# EAGLE design SPI-i2c-PWM --v1 (EAGLE 9.5.2)
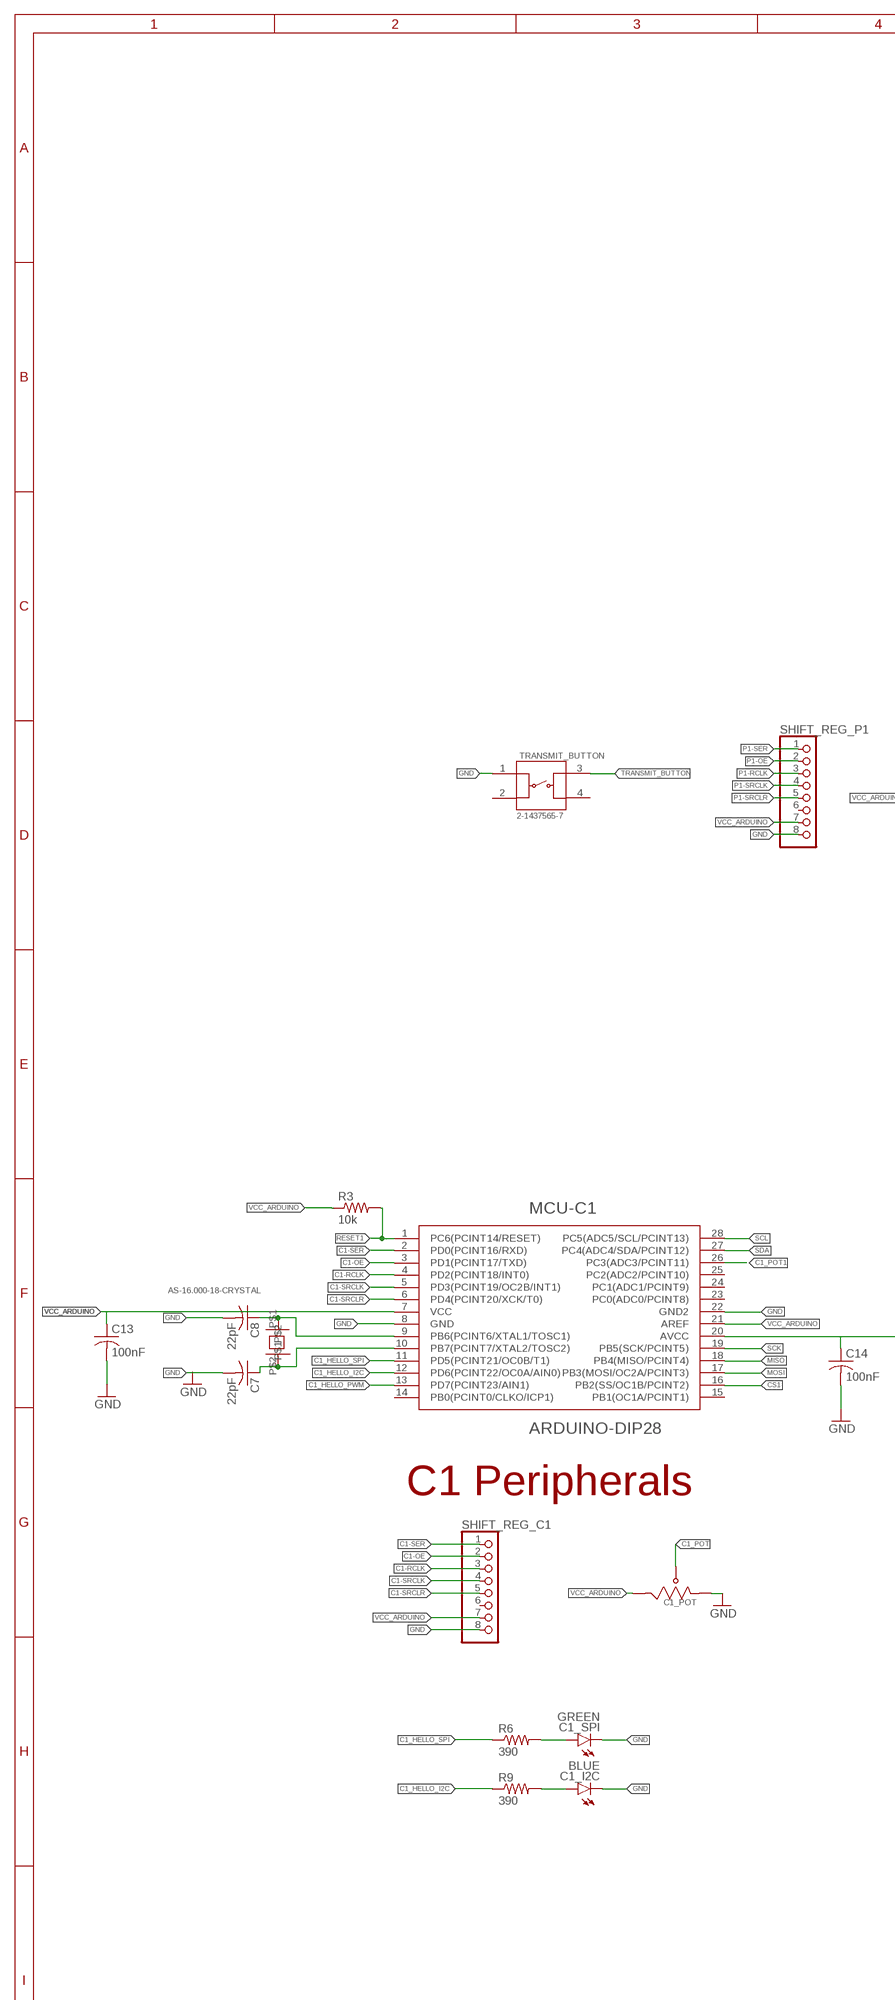
[diagram p0: schematic, sheet 1, part 1 of 2]
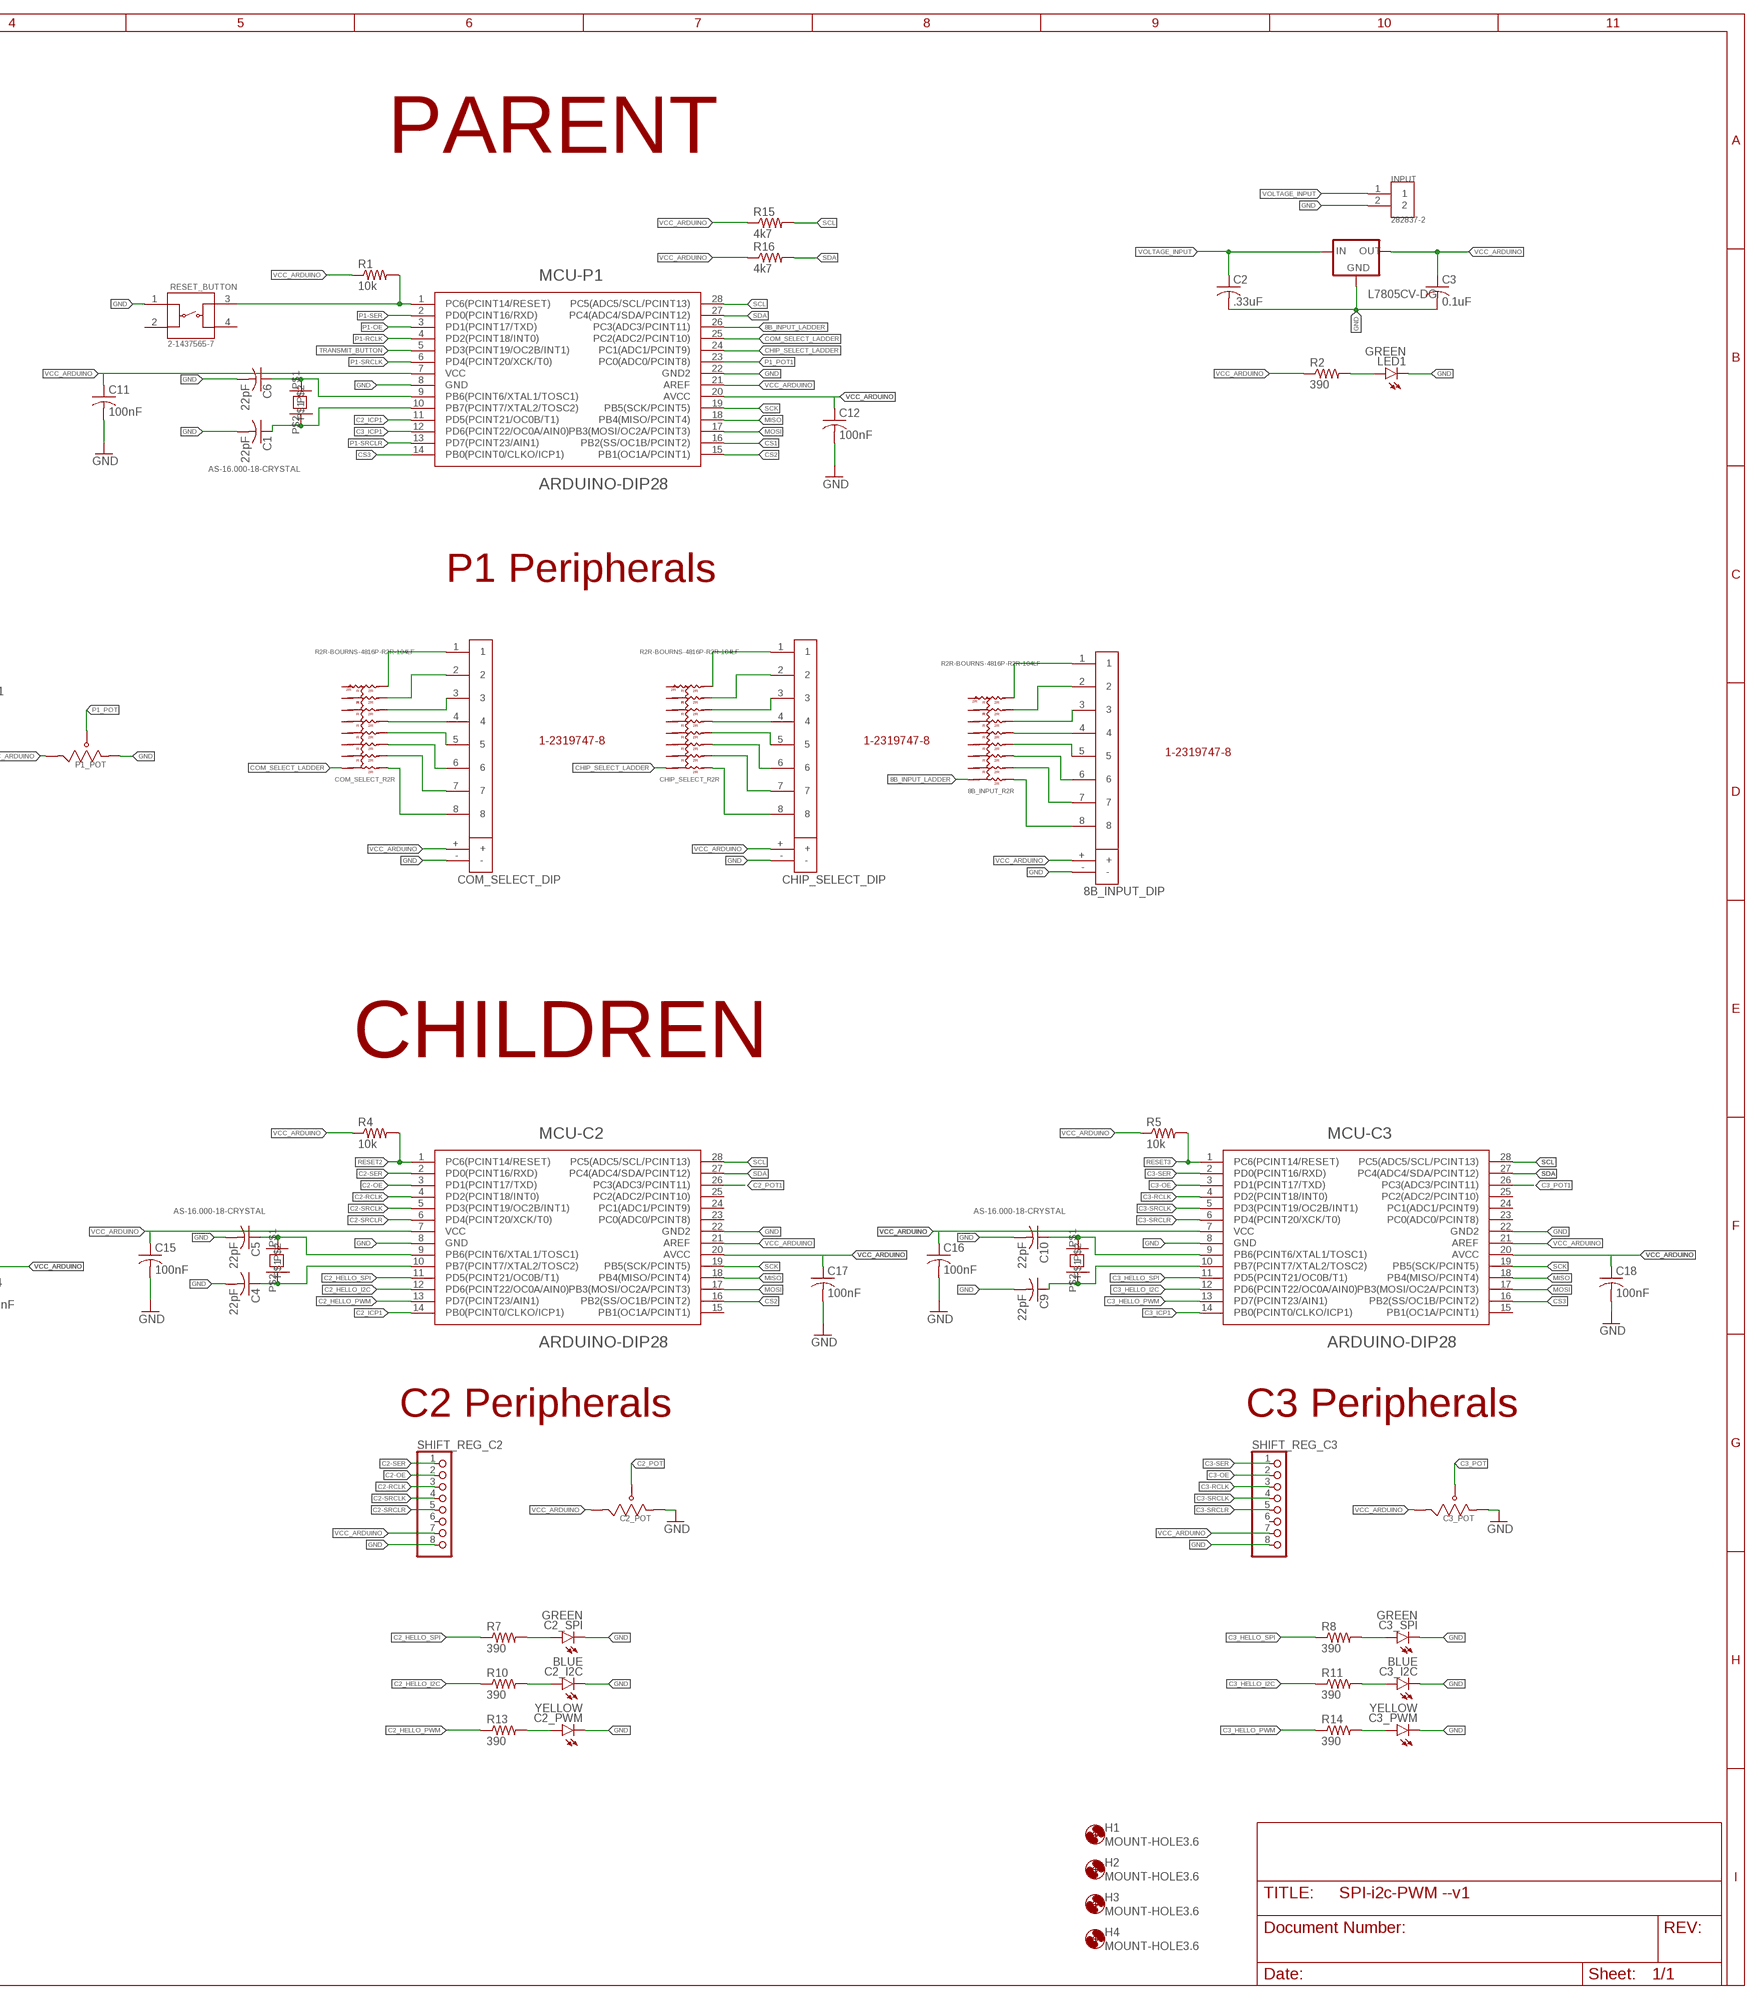
[diagram p1: schematic, sheet 1, part 2 of 2]

## Parts
5V_REG  L7805CV-DG  78XXS  [78XXS]
8B_INPUT_DIP  DIP8-TE  [DIP8-TE(1-2319747-8)]
8B_INPUT_R2R  R2R-BOURNS-4816P-R2R-104LF  [R2RLADDER]
C1  22pF  C-USC0805  [C0805]
C1_I2C  BLUE  LEDCHIP-LED0805  [CHIP-LED0805]
C1_POT  POTENTIOMETER-ALLIE  [POT-ALLIEEXPRESS]
C1_SPI  GREEN  LEDCHIP-LED0805  [CHIP-LED0805]
C2  .33uF  C-USC0805  [C0805]
C2_I2C  BLUE  LEDCHIP-LED0805  [CHIP-LED0805]
C2_POT  POTENTIOMETER-ALLIE  [POT-ALLIEEXPRESS]
C2_PWM  YELLOW  LEDCHIP-LED0805  [CHIP-LED0805]
C2_SPI  GREEN  LEDCHIP-LED0805  [CHIP-LED0805]
C3  0.1uF  C-USC0805  [C0805]
C3_I2C  BLUE  LEDCHIP-LED0805  [CHIP-LED0805]
C3_POT  POTENTIOMETER-ALLIE  [POT-ALLIEEXPRESS]
C3_PWM  YELLOW  LEDCHIP-LED0805  [CHIP-LED0805]
C3_SPI  GREEN  LEDCHIP-LED0805  [CHIP-LED0805]
C4  22pF  C-USC0805  [C0805]
C5  22pF  C-USC0805  [C0805]
C6  22pF  C-USC0805  [C0805]
C7  22pF  C-USC0805  [C0805]
C8  22pF  C-USC0805  [C0805]
C9  22pF  C-USC0805  [C0805]
C10  22pF  C-USC0805  [C0805]
C11  100nF  C-USC0805  [C0805]
C12  100nF  C-USC0805  [C0805]
C13  100nF  C-USC0805  [C0805]
C14  100nF  C-USC0805  [C0805]
C15  100nF  C-USC0805  [C0805]
C16  100nF  C-USC0805  [C0805]
C17  100nF  C-USC0805  [C0805]
C18  100nF  C-USC0805  [C0805]
CHIP_SELECT_DIP  DIP8-TE  [DIP8-TE(1-2319747-8)]
CHIP_SELECT_R2R  R2R-BOURNS-4816P-R2R-104LF  [R2RLADDER]
COM_SELECT_DIP  DIP8-TE  [DIP8-TE(1-2319747-8)]
COM_SELECT_R2R  R2R-BOURNS-4816P-R2R-104LF  [R2RLADDER]
H1  MOUNT-HOLE3.6  [3,6]
H2  MOUNT-HOLE3.6  [3,6]
H3  MOUNT-HOLE3.6  [3,6]
H4  MOUNT-HOLE3.6  [3,6]
INPUT  282837-2  [TE_282837-2]
LED1  GREEN  LEDCHIPLED_0805  [CHIPLED_0805]
M1_OSC  AS-16.000-18-CRYSTAL  [AS-16.000-18-CRYSTAL]
MCU-C1  ARDUINO-DIP28  [DIL28-3]
MCU-C2  ARDUINO-DIP28  [DIL28-3]
MCU-C3  ARDUINO-DIP28  [DIL28-3]
MCU-P1  ARDUINO-DIP28  [DIL28-3]
P1_POT  POTENTIOMETER-ALLIE  [POT-ALLIEEXPRESS]
R1  10k  R-US_M0805  [M0805]
R2  390  R-US_R0805  [R0805]
R3  10k  R-US_M0805  [M0805]
R4  10k  R-US_M0805  [M0805]
R5  10k  R-US_M0805  [M0805]
R6  390  R-US_M0805  [M0805]
R7  390  R-US_M0805  [M0805]
R8  390  R-US_M0805  [M0805]
R9  390  R-US_M0805  [M0805]
R10  390  R-US_M0805  [M0805]
R11  390  R-US_M0805  [M0805]
R13  390  R-US_M0805  [M0805]
R14  390  R-US_M0805  [M0805]
R15  4k7  R-US_R0805  [R0805]
R16  4k7  R-US_R0805  [R0805]
RESET_BUTTON  2-1437565-7  [SW_2-1437565-7]
S1_OSC  AS-16.000-18-CRYSTAL  [AS-16.000-18-CRYSTAL]
S2_OSC  AS-16.000-18-CRYSTAL  [AS-16.000-18-CRYSTAL]
S3_OSC  AS-16.000-18-CRYSTAL  [AS-16.000-18-CRYSTAL]
SHIFT_REG_C1  PINHD-1X8  [1X08]
SHIFT_REG_C2  PINHD-1X8  [1X08]
SHIFT_REG_C3  PINHD-1X8  [1X08]
SHIFT_REG_P1  PINHD-1X8  [1X08]
TRANSMIT_BUTTON  2-1437565-7  [SW_2-1437565-7]

## Nets
8B_INPUT_LADDER: 8B_INPUT_R2R.16 MCU-P1.26(PC3(ADC3/PCINT11))
C1-OE: MCU-C1.3(PD1(PCINT17/TXD)) SHIFT_REG_C1.2
C1-RCLK: MCU-C1.4(PD2(PCINT18/INT0)) SHIFT_REG_C1.3
C1-SER: MCU-C1.2(PD0(PCINT16/RXD)) SHIFT_REG_C1.1
C1-SRCLK: MCU-C1.5(PD3(PCINT19/OC2B/INT1)) SHIFT_REG_C1.4
C1-SRCLR: MCU-C1.6(PD4(PCINT20/XCK/T0)) SHIFT_REG_C1.5
C1_HELLO_I2C: MCU-C1.12(PD6(PCINT22/OC0A/AIN0)) R9.1
C1_HELLO_PWM: MCU-C1.13(PD7(PCINT23/AIN1))
C1_HELLO_SPI: MCU-C1.11(PD5(PCINT21/OC0B/T1)) R6.1
C1_POT: C1_POT.P$2
C1_POT1: MCU-C1.26(PC3(ADC3/PCINT11))
C2-OE: MCU-C2.3(PD1(PCINT17/TXD)) SHIFT_REG_C2.2
C2-RCLK: MCU-C2.4(PD2(PCINT18/INT0)) SHIFT_REG_C2.3
C2-SER: MCU-C2.2(PD0(PCINT16/RXD)) SHIFT_REG_C2.1
C2-SRCLK: MCU-C2.5(PD3(PCINT19/OC2B/INT1)) SHIFT_REG_C2.4
C2-SRCLR: MCU-C2.6(PD4(PCINT20/XCK/T0)) SHIFT_REG_C2.5
C2_HELLO_I2C: MCU-C2.12(PD6(PCINT22/OC0A/AIN0)) R10.1
C2_HELLO_PWM: MCU-C2.13(PD7(PCINT23/AIN1)) R13.1
C2_HELLO_SPI: MCU-C2.11(PD5(PCINT21/OC0B/T1)) R7.1
C2_ICP1: MCU-C2.14(PB0(PCINT0/CLKO/ICP1)) MCU-P1.11(PD5(PCINT21/OC0B/T1))
C2_POT: C2_POT.P$2
C2_POT1: MCU-C2.26(PC3(ADC3/PCINT11))
C3-OE: MCU-C3.3(PD1(PCINT17/TXD)) SHIFT_REG_C3.2
C3-RCLK: MCU-C3.4(PD2(PCINT18/INT0)) SHIFT_REG_C3.3
C3-SER: MCU-C3.2(PD0(PCINT16/RXD)) SHIFT_REG_C3.1
C3-SRCLK: MCU-C3.5(PD3(PCINT19/OC2B/INT1)) SHIFT_REG_C3.4
C3-SRCLR: MCU-C3.6(PD4(PCINT20/XCK/T0)) SHIFT_REG_C3.5
C3_HELLO_I2C: MCU-C3.12(PD6(PCINT22/OC0A/AIN0)) R11.1
C3_HELLO_PWM: MCU-C3.13(PD7(PCINT23/AIN1)) R14.1
C3_HELLO_SPI: MCU-C3.11(PD5(PCINT21/OC0B/T1)) R8.1
C3_ICP1: MCU-C3.14(PB0(PCINT0/CLKO/ICP1)) MCU-P1.12(PD6(PCINT22/OC0A/AIN0))
C3_POT: C3_POT.P$2
C3_POT1: MCU-C3.26(PC3(ADC3/PCINT11))
CHIP_SELECT_LADDER: CHIP_SELECT_R2R.16 MCU-P1.24(PC1(ADC1/PCINT9))
COM_SELECT_LADDER: COM_SELECT_R2R.16 MCU-P1.25(PC2(ADC2/PCINT10))
CS1: MCU-C1.16(PB2(SS/OC1B/PCINT2)) MCU-P1.16(PB2(SS/OC1B/PCINT2))
CS2: MCU-C2.16(PB2(SS/OC1B/PCINT2)) MCU-P1.15(PB1(OC1A/PCINT1))
CS3: MCU-C3.16(PB2(SS/OC1B/PCINT2)) MCU-P1.14(PB0(PCINT0/CLKO/ICP1))
GND: 5V_REG.GND 8B_INPUT_DIP.- C1.2 C1_I2C.C C1_POT.P$3 C1_SPI.C C2.2 C2_I2C.C C2_POT.P$3 C2_PWM.C C2_SPI.C C3.2 C3_I2C.C C3_POT.P$3 C3_PWM.C C3_SPI.C C4.2 C5.2 C6.2 C7.2 C8.2 C9.2 C10.2 C11.2 C12.2 C13.2 C14.2 C15.2 C16.2 C17.2 C18.2 CHIP_SELECT_DIP.- COM_SELECT_DIP.- INPUT.2 LED1.C MCU-C1.8(GND) MCU-C1.22(GND2) MCU-C2.8(GND) MCU-C2.22(GND2) MCU-C3.8(GND) MCU-C3.22(GND2) MCU-P1.8(GND) MCU-P1.22(GND2) P1_POT.P$3 RESET_BUTTON.1 SHIFT_REG_C1.8 SHIFT_REG_C2.8 SHIFT_REG_C3.8 SHIFT_REG_P1.8 TRANSMIT_BUTTON.1
MISO: MCU-C1.18(PB4(MISO/PCINT4)) MCU-C2.18(PB4(MISO/PCINT4)) MCU-C3.18(PB4(MISO/PCINT4)) MCU-P1.18(PB4(MISO/PCINT4))
MOSI: MCU-C1.17(PB3(MOSI/OC2A/PCINT3)) MCU-C2.17(PB3(MOSI/OC2A/PCINT3)) MCU-C3.17(PB3(MOSI/OC2A/PCINT3)) MCU-P1.17(PB3(MOSI/OC2A/PCINT3))
N$1: LED1.A R2.2
N$2: C8.1 MCU-C1.9(PB6(PCINT6/XTAL1/TOSC1)) S1_OSC.P$1
N$3: C7.1 MCU-C1.10(PB7(PCINT7/XTAL2/TOSC2)) S1_OSC.P$2
N$4: 8B_INPUT_DIP.1 8B_INPUT_R2R.8
N$5: C6.1 M1_OSC.P$1 MCU-P1.9(PB6(PCINT6/XTAL1/TOSC1))
N$6: C1.1 M1_OSC.P$2 MCU-P1.10(PB7(PCINT7/XTAL2/TOSC2))
N$7: C5.1 MCU-C2.9(PB6(PCINT6/XTAL1/TOSC1)) S2_OSC.P$1
N$8: C4.1 MCU-C2.10(PB7(PCINT7/XTAL2/TOSC2)) S2_OSC.P$2
N$9: C10.1 MCU-C3.9(PB6(PCINT6/XTAL1/TOSC1)) S3_OSC.P$1
N$10: C9.1 MCU-C3.10(PB7(PCINT7/XTAL2/TOSC2)) S3_OSC.P$2
N$11: 8B_INPUT_DIP.2 8B_INPUT_R2R.7
N$12: C1_SPI.A R6.2
N$13: C2_SPI.A R7.2
N$14: C3_SPI.A R8.2
N$15: C1_I2C.A R9.2
N$16: C2_I2C.A R10.2
N$17: C3_I2C.A R11.2
N$18: COM_SELECT_DIP.1 COM_SELECT_R2R.8
N$19: C2_PWM.A R13.2
N$20: C3_PWM.A R14.2
N$21: 8B_INPUT_DIP.3 8B_INPUT_R2R.6
N$22: 8B_INPUT_DIP.4 8B_INPUT_R2R.5
N$23: 8B_INPUT_DIP.5 8B_INPUT_R2R.4
N$24: 8B_INPUT_DIP.6 8B_INPUT_R2R.3
N$25: 8B_INPUT_DIP.7 8B_INPUT_R2R.2
N$26: 8B_INPUT_DIP.8 8B_INPUT_R2R.1
N$27: COM_SELECT_DIP.2 COM_SELECT_R2R.7
N$28: COM_SELECT_DIP.3 COM_SELECT_R2R.6
N$29: COM_SELECT_DIP.4 COM_SELECT_R2R.5
N$30: COM_SELECT_DIP.5 COM_SELECT_R2R.4
N$31: COM_SELECT_DIP.6 COM_SELECT_R2R.3
N$32: COM_SELECT_DIP.7 COM_SELECT_R2R.2
N$33: COM_SELECT_DIP.8 COM_SELECT_R2R.1
N$34: CHIP_SELECT_DIP.1 CHIP_SELECT_R2R.8
N$35: CHIP_SELECT_DIP.2 CHIP_SELECT_R2R.7
N$36: CHIP_SELECT_DIP.3 CHIP_SELECT_R2R.6
N$37: CHIP_SELECT_DIP.4 CHIP_SELECT_R2R.5
N$38: CHIP_SELECT_DIP.5 CHIP_SELECT_R2R.4
N$39: CHIP_SELECT_DIP.6 CHIP_SELECT_R2R.3
N$40: CHIP_SELECT_DIP.7 CHIP_SELECT_R2R.2
N$41: CHIP_SELECT_DIP.8 CHIP_SELECT_R2R.1
P1-OE: MCU-P1.3(PD1(PCINT17/TXD)) SHIFT_REG_P1.2
P1-RCLK: MCU-P1.4(PD2(PCINT18/INT0)) SHIFT_REG_P1.3
P1-SER: MCU-P1.2(PD0(PCINT16/RXD)) SHIFT_REG_P1.1
P1-SRCLK: MCU-P1.6(PD4(PCINT20/XCK/T0)) SHIFT_REG_P1.4
P1-SRCLR: MCU-P1.13(PD7(PCINT23/AIN1)) SHIFT_REG_P1.5
P1_POT: P1_POT.P$2
P1_POT1: MCU-P1.23(PC0(ADC0/PCINT8))
RESET1: MCU-C1.1(PC6(PCINT14/RESET)) R3.2
RESET2: MCU-C2.1(PC6(PCINT14/RESET)) R4.2
RESET3: MCU-C3.1(PC6(PCINT14/RESET)) R5.2
RESET_BUTTON: MCU-P1.1(PC6(PCINT14/RESET)) R1.2 RESET_BUTTON.3
SCK: MCU-C1.19(PB5(SCK/PCINT5)) MCU-C2.19(PB5(SCK/PCINT5)) MCU-C3.19(PB5(SCK/PCINT5)) MCU-P1.19(PB5(SCK/PCINT5))
SCL: MCU-C1.28(PC5(ADC5/SCL/PCINT13)) MCU-C2.28(PC5(ADC5/SCL/PCINT13)) MCU-C3.28(PC5(ADC5/SCL/PCINT13)) MCU-P1.28(PC5(ADC5/SCL/PCINT13)) R15.2
SDA: MCU-C1.27(PC4(ADC4/SDA/PCINT12)) MCU-C2.27(PC4(ADC4/SDA/PCINT12)) MCU-C3.27(PC4(ADC4/SDA/PCINT12)) MCU-P1.27(PC4(ADC4/SDA/PCINT12)) R16.2
TRANSMIT_BUTTON: MCU-P1.5(PD3(PCINT19/OC2B/INT1)) TRANSMIT_BUTTON.3
VCC_ARDUINO [arduino_vcc]: 5V_REG.OUT 8B_INPUT_DIP.+ C1_POT.P$1 C2_POT.P$1 C3.1 C3_POT.P$1 C11.1 C12.1 C13.1 C14.1 C15.1 C16.1 C17.1 C18.1 CHIP_SELECT_DIP.+ COM_SELECT_DIP.+ MCU-C1.7(VCC) MCU-C1.20(AVCC) MCU-C1.21(AREF) MCU-C2.7(VCC) MCU-C2.20(AVCC) MCU-C2.21(AREF) MCU-C3.7(VCC) MCU-C3.20(AVCC) MCU-C3.21(AREF) MCU-P1.7(VCC) MCU-P1.20(AVCC) MCU-P1.21(AREF) P1_POT.P$1 R1.1 R2.1 R3.1 R4.1 R5.1 R15.1 R16.1 SHIFT_REG_C1.7 SHIFT_REG_C2.7 SHIFT_REG_C3.7 SHIFT_REG_P1.7
VOLTAGE_INPUT [arduino_vcc]: 5V_REG.IN C2.1 INPUT.1
Unconnected: 8B_INPUT_R2R.9 8B_INPUT_R2R.10 8B_INPUT_R2R.11 8B_INPUT_R2R.12 8B_INPUT_R2R.13 8B_INPUT_R2R.14 8B_INPUT_R2R.15 CHIP_SELECT_R2R.9 CHIP_SELECT_R2R.10 CHIP_SELECT_R2R.11 CHIP_SELECT_R2R.12 CHIP_SELECT_R2R.13 CHIP_SELECT_R2R.14 CHIP_SELECT_R2R.15 COM_SELECT_R2R.9 COM_SELECT_R2R.10 COM_SELECT_R2R.11 COM_SELECT_R2R.12 COM_SELECT_R2R.13 COM_SELECT_R2R.14 COM_SELECT_R2R.15 MCU-C1.14(PB0(PCINT0/CLKO/ICP1)) MCU-C1.15(PB1(OC1A/PCINT1)) MCU-C1.23(PC0(ADC0/PCINT8)) MCU-C1.24(PC1(ADC1/PCINT9)) MCU-C1.25(PC2(ADC2/PCINT10)) MCU-C2.15(PB1(OC1A/PCINT1)) MCU-C2.23(PC0(ADC0/PCINT8)) MCU-C2.24(PC1(ADC1/PCINT9)) MCU-C2.25(PC2(ADC2/PCINT10)) MCU-C3.15(PB1(OC1A/PCINT1)) MCU-C3.23(PC0(ADC0/PCINT8)) MCU-C3.24(PC1(ADC1/PCINT9)) MCU-C3.25(PC2(ADC2/PCINT10)) RESET_BUTTON.2 RESET_BUTTON.4 SHIFT_REG_C1.6 SHIFT_REG_C2.6 SHIFT_REG_C3.6 SHIFT_REG_P1.6 TRANSMIT_BUTTON.2 TRANSMIT_BUTTON.4

## Notes on the sheet
- PARENT
- P1 Peripherals
- CHILDREN
- C1 Peripherals | C2 Peripherals | C3 Peripherals

## Library data of the parts
5V_REG = v-reg:78XXS: VOLTAGE REGULATOR
8B_INPUT_DIP CHIP_SELECT_DIP COM_SELECT_DIP = peter ford222:DIP8-TE
8B_INPUT_R2R CHIP_SELECT_R2R COM_SELECT_R2R = peter ford222:R2R-BOURNS-4816P-R2R-104LF
C1-C18 = resistor:C-US: CAPACITOR, American symbol
C1_I2C C1_SPI C2_I2C C2_PWM C2_SPI C3_I2C C3_PWM C3_SPI LED1 = led:LED: LED OSRAM: - CHIPLED LG R971, LG N971, LY N971, LG Q971, LY Q971, LO R971, LY R971 LH N974, LH R974 LS Q976, LO Q976, LY Q976 LO Q996 - Hyper CHIPLED LW Q18S LB Q993, LB Q99A, LB R99A - SideLED LS A670, LO A670, LY A670, LG A670, LP A670 LB A673, LV A673, LT A673, LW A673 LH A674 LY A675 LS A676, LA A676, LO A676, LY A676, LW A676 LS A679, LY A679, LG A679 - Hyper Micro SIDELED® LS Y876, LA Y876, LO Y876, LY Y876 LT Y87S - SmartLED LW L88C, LW L88S LB L89C, LB L89S, LG L890 LS L89K, LO L89K, LY L89K LS L896, LA L896, LO L896, LY L896 - TOPLED LS T670, LO T670, LY T670, LG T670, LP T670 LSG T670, LSP T670, LSY T670, LOP T670, LYG T670 LG T671, LOG T671, LSG T671 LB T673, LV T673, LT T673, LW T673 LH T674 LS T676, LA T676, LO T676, LY T676, LB T676, LH T676, LSB T676, LW T676 LB T67C, LV T67C, LT T67C, LS T67K, LO T67K, LY T67K, LW E67C LS E67B, LA E67B, LO E67B, LY E67B, LB E67C, LV E67C, LT E67C LW T67C LS T679, LY T679, LG T679 LS T770, LO T770, LY T770, LG T770, LP T770 LB T773, LV T773, LT T773, LW T773 LH T774 LS E675, LA E675, LY E675, LS T675 LS T776, LA T776, LO T776, LY T776, LB T776 LHGB T686 LT T68C, LB T68C - Hyper Mini TOPLED® LB M676 - Mini TOPLED Santana® LG M470 LS M47K, LO M47K, LY M47K Source: http://www.osram.convergy.de LUXEON: - LUMILED® LXK2-PW12-R00, LXK2-PW12-S00, LXK2-PW14-U00, LXK2-PW14-V00 LXK2-PM12-R00, LXK2-PM12-S00, LXK2-PM14-U00 LXK2-PE12-Q00, LXK2-PE12-R00, LXK2-PE12-S00, LXK2-PE14-T00, LXK2-PE14-U00 LXK2-PB12-K00, LXK2-PB12-L00, LXK2-PB12-M00, LXK2-PB14-N00, LXK2-PB14-P00, LXK2-PB14-Q00 LXK2-PR12-L00, LXK2-PR12-M00, LXK2-PR14-Q00, LXK2-PR14-R00 LXK2-PD12-Q00, LXK2-PD12-R00, LXK2-PD12-S00 LXK2-PH12-R00, LXK2-PH12-S00 LXK2-PL12-P00, LXK2-PL12-Q00, LXK2-PL12-R00 Source: www.luxeon.com KINGBRIGHT: KA-3528ASYC Source: www.kingbright.com
C1_POT C2_POT C3_POT P1_POT = peter ford222:POTENTIOMETER-ALLIE
H1-H4 = holes:MOUNT-HOLE: MOUNTING HOLE with drill center marker
INPUT = 282837-2:282837-2: TERM BLOCK 5.08MM 2POS SIDE ENTY; AVAILABILITY: Good; DESCRIPTION: TERMINAL BLOCK 3.5MM 2POS PCB; MF: On Shore; MP: OSTTE020104; PACKAGE: None; PARTREV: G3; PRICE: 0.28 USD
M1_OSC S1_OSC S2_OSC S3_OSC = peter ford222:AS-16.000-18-CRYSTAL
MCU-C1-MCU-C3 MCU-P1 = peter ford222:ARDUINO-DIP28
R1-R11 R13-R16 = resistor:R-US_: RESISTOR, American symbol
RESET_BUTTON TRANSMIT_BUTTON = 2-1437565-7:2-1437565-7: FSM2JSMA=SMT,TACTILE,PB SWITCH; MANUFACTURER: TE Connectivity; PARTREV: V; STANDARD: Manufacturer recommendations
SHIFT_REG_C1-SHIFT_REG_C3 SHIFT_REG_P1 = pinhead:PINHD-1X8: PIN HEADER

## Net classes
0 default: width 0.203 mm, clearance 0.203 mm
1 arduino_vcc: width 0.508 mm, clearance 0.203 mm

## Board
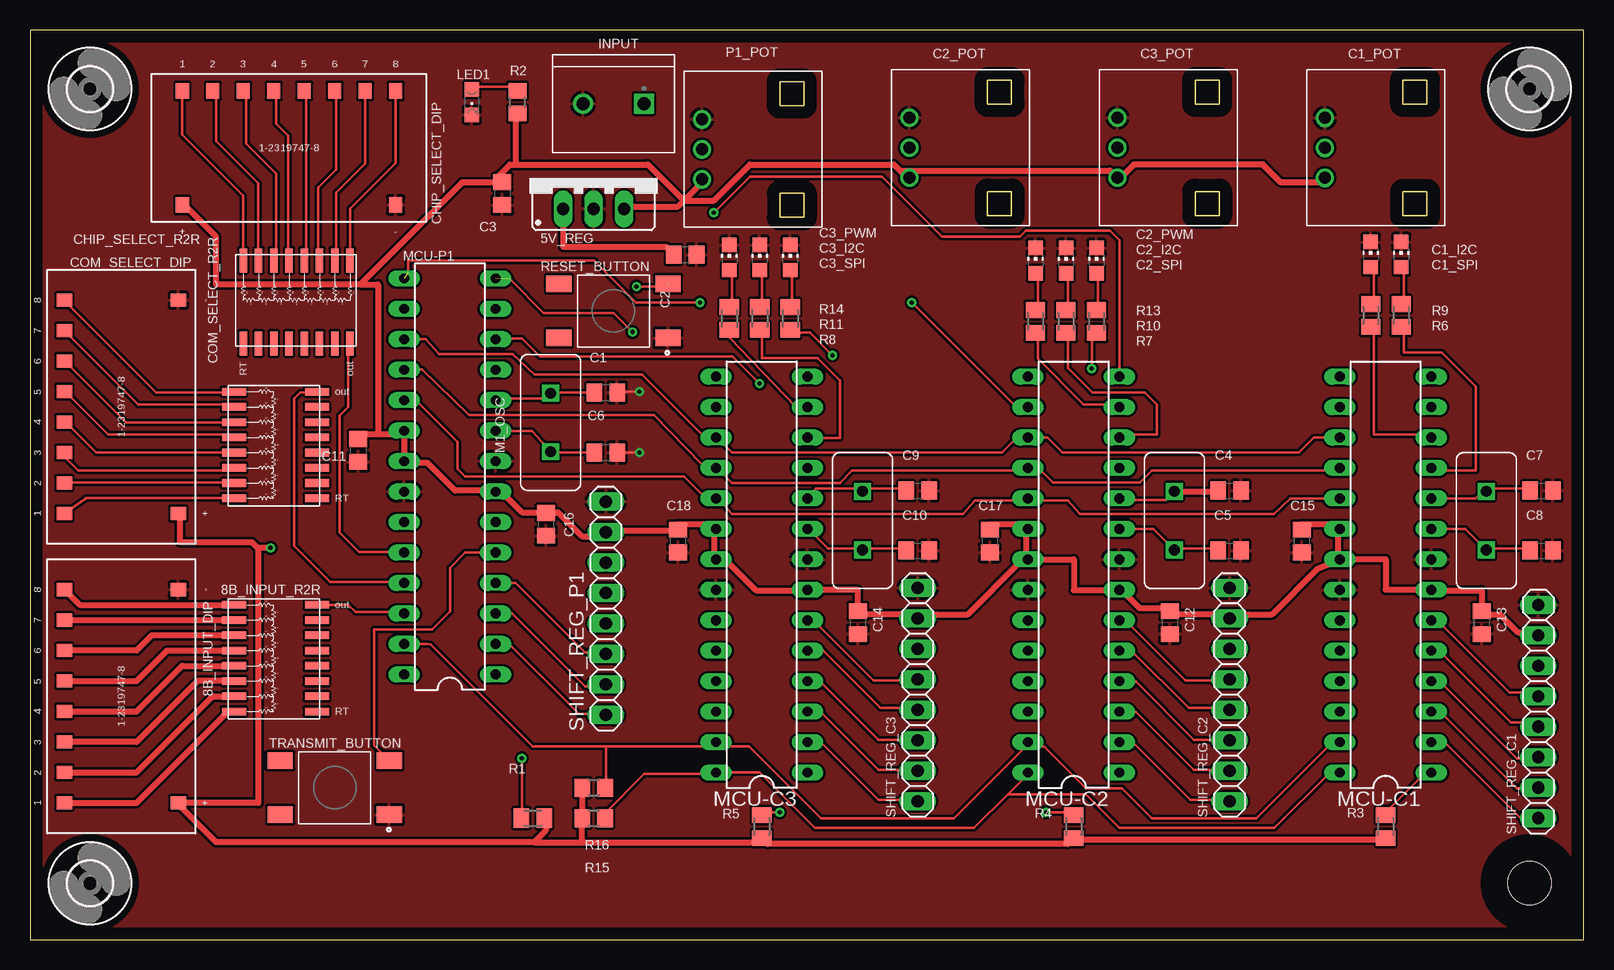
[diagram p2: board, top side]
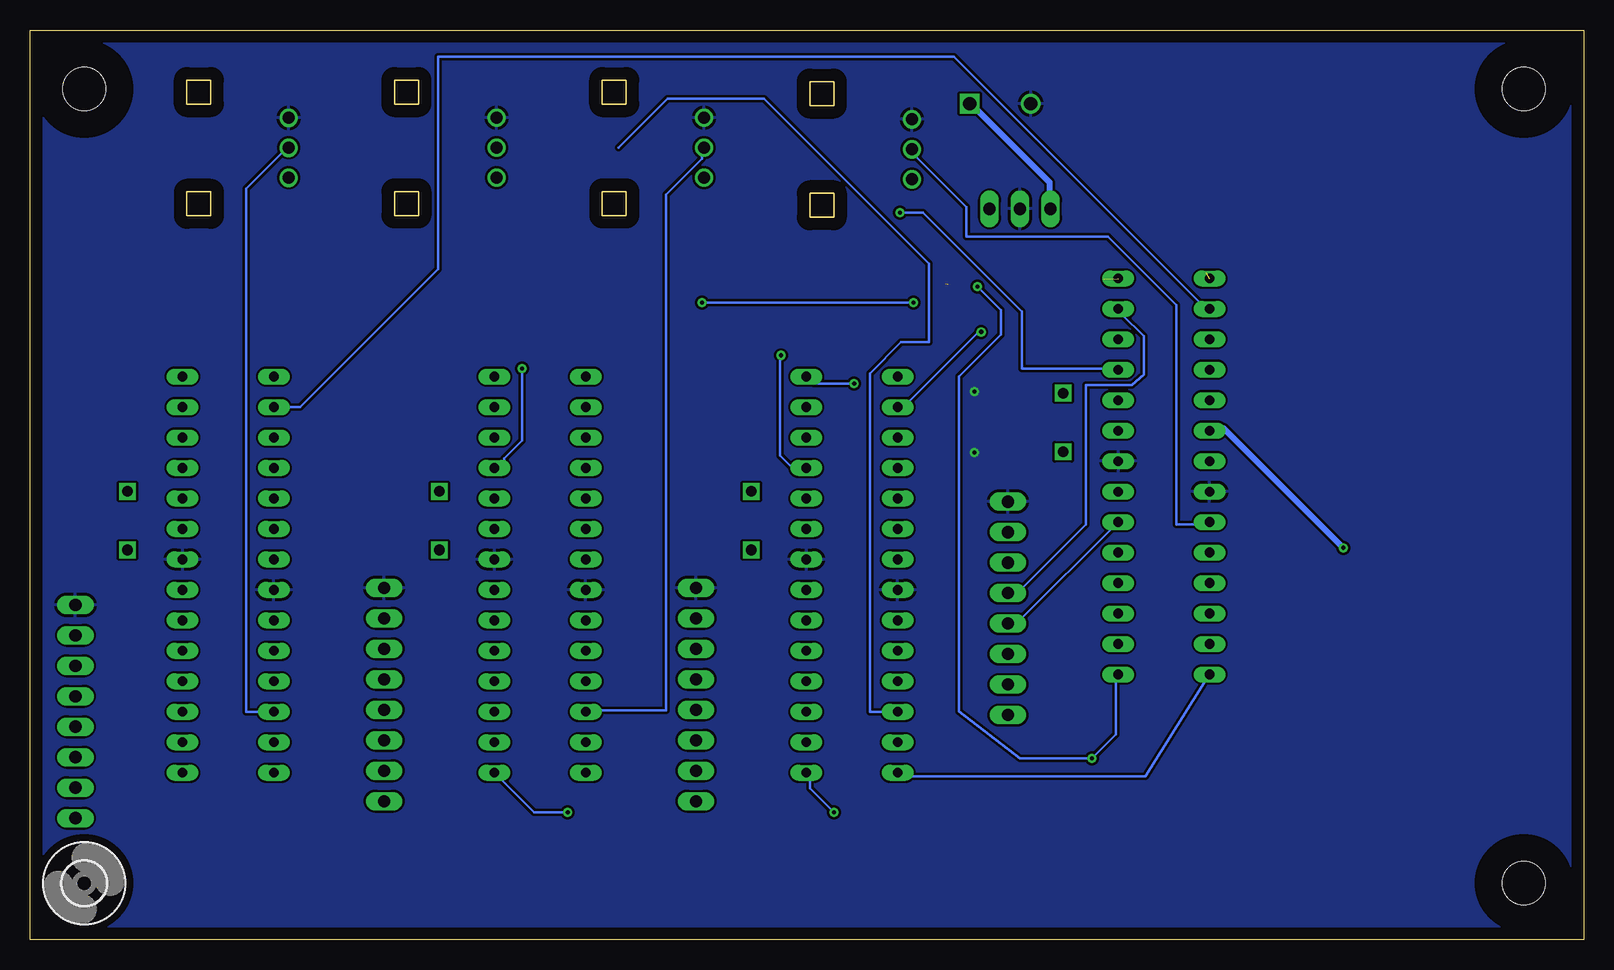
[diagram p3: board, bottom side, seen from below]

Size 129.52 x 75.87 mm. Coordinates in mm from the lower left corner, seen from the top.
Outline: 0,0 129.52,0 129.52,75.87 0,75.87 0,0
Copper layers (1*16): Top 0.035mm / dielectric 1.5mm / Bottom 0.035mm
Design rules "default *": minimum track width 6mil, minimum drill 0.35mm, track to track 6mil, track to pad 6mil, pad to pad 6mil, via to via 6mil, smd to smd 6mil, copper to edge 40mil, drill to drill 6mil, minimum pad ring 10mil, minimum via ring 8mil, stop-mask expansion 4mil, vias tented up to drill 0mil, thermal gap 10mil

### Footprints (pad centres in the part's own frame; a part is rotated, then mirrored left to right if it is on the bottom)
78XXS = drill 1.016 long: GND 0,-2.54; IN -2.54,-2.54; OUT 2.54,-2.54
DIP8-TE(1-2319747-8) = smd 1.1 x 1.3: 1 0,4.75; 2 2.54,4.75; 3 5.08,4.75; 4 7.62,4.75; 5 10.16,4.75; 6 12.7,4.75; 7 15.24,4.75; 8 17.78,4.75; + 0,-4.75; - 17.78,-4.75
R2RLADDER = smd 2 x 0.63: 1 -3.302,5.08; 2 -3.302,3.81; 3 -3.302,2.54; 4 -3.302,1.27; 5 -3.302,0; 6 -3.302,-1.27; 7 -3.302,-2.54; 8 -3.302,-3.81; 9 3.598,-3.81; 10 3.598,-2.54; 11 3.598,-1.27; 12 3.598,0; 13 3.598,1.27; 14 3.598,2.54; 15 3.598,3.81; 16 3.598,5.08
C0805 = smd 1.3 x 1.5: 1 -0.95,0; 2 0.95,0
CHIP-LED0805 = smd 1.2 x 1.2: A 0,-1.05; C 0,1.05
POT-ALLIEEXPRESS = drill 1: P$1 -2.5,0; P$2 0,0; P$3 2.5,0
3,6 = hole 3.6: 0,0
TE_282837-2 = drill 1.1 square: 1 -2.54,0 | drill 1.1: 2 2.54,0
CHIPLED_0805 = smd 1.2 x 1.2: A 0,-1.05; C 0,1.05
AS-16.000-18-CRYSTAL = drill 0.889 square: P$1 -2.44,0; P$2 2.44,0
DIL28-3 = drill 0.813 long: 1 -16.51,-3.81; 2 -13.97,-3.81; 3 -11.43,-3.81; 4 -8.89,-3.81; 5 -6.35,-3.81; 6 -3.81,-3.81; 7 -1.27,-3.81; 8 1.27,-3.81; 9 3.81,-3.81; 10 6.35,-3.81; 11 8.89,-3.81; 12 11.43,-3.81; 13 13.97,-3.81; 14 16.51,-3.81; 15 16.51,3.81; 16 13.97,3.81; 17 11.43,3.81; 18 8.89,3.81; 19 6.35,3.81; 20 3.81,3.81; 21 1.27,3.81; 22 -1.27,3.81; 23 -3.81,3.81; 24 -6.35,3.81; 25 -8.89,3.81; 26 -11.43,3.81; 27 -13.97,3.81; 28 -16.51,3.81
M0805 = smd 1.3 x 1.6: 1 -0.95,0; 2 0.95,0
R0805 = smd 1.3 x 1.5: 1 -0.95,0; 2 0.95,0
SW_2-1437565-7 = smd 2.1 x 1.4: 1 -4.55,2.25; 2 4.55,2.25; 3 -4.55,-2.25; 4 4.55,-2.25
1X08 = drill 1.016 long: 1 -8.89,0; 2 -6.35,0; 3 -3.81,0; 4 -1.27,0; 5 1.27,0; 6 3.81,0; 7 6.35,0; 8 8.89,0

### Placement (x,y rotation side)
5V_REG  46.99,63.5 0 top
8B_INPUT_DIP  7.62,11.43 90 top
8B_INPUT_R2R  20.32,22.86 0 top
C1  48,45.65 0 top
C1_I2C  111.76,57.15 0 top
C1_POT  107.95,66.04 90 top
C1_SPI  114.3,57.15 0 top
C2  54.61,57.15 0 top
C2_I2C  86.36,56.64 0 top
C2_POT  73.32,66.05 90 top
C2_PWM  83.82,56.64 0 top
C2_SPI  88.9,56.64 0 top
C3  39.37,62.23 270 top
C3_I2C  60.83,56.9 0 top
C3_POT  90.64,66.05 90 top
C3_PWM  58.29,56.9 0 top
C3_SPI  63.37,56.9 0 top
C4  100,37.46 0 top
C5  100,32.46 0 top
C6  48,40.65 0 top
C7  126,37.46 0 top
C8  126,32.46 0 top
C9  74,37.46 0 top
C10  74,32.46 0 top
C11  27.36,40.82 270 top
C12  95,26.46 270 top
C13  121,26.46 270 top
C14  69,26.46 270 top
C15  106,33.26 270 top
C16  43,34.65 270 top
C17  80,33.26 270 top
C18  54,33.26 270 top
CHIP_SELECT_DIP  12.7,66.04 0 top
CHIP_SELECT_R2R  21.59,53.34 270 top
COM_SELECT_DIP  7.62,35.56 90 top
COM_SELECT_R2R  20.32,40.64 0 top
H1  5,70.95 0 top
H2  125,4.73 0 bottom
H3  125,70.95 0 top
H4  5,4.73 0 top
INPUT  48.64,69.72 180 top
LED1  36.83,69.85 180 top
M1_OSC  43.4,43.15 90 top
MCU-C1  113,30.46 90 top
MCU-C2  87,30.46 90 top
MCU-C3  61,30.46 90 top
MCU-P1  35,38.65 90 top
P1_POT  56.01,65.91 90 top
R1  41.91,10.16 180 top
R2  40.64,69.85 90 top
R3  113,9.46 90 top
R4  87,9.46 90 top
R5  61,9.46 90 top
R6  114.3,52.07 90 top
R7  88.9,51.56 90 top
R8  63.37,51.82 90 top
R9  111.76,52.07 90 top
R10  86.36,51.56 90 top
R11  60.83,51.82 90 top
R13  83.82,51.56 90 top
R14  58.29,51.82 90 top
R15  46.99,10.16 0 top
R16  46.99,12.7 0 top
RESET_BUTTON  48.64,52.45 180 top
S1_OSC  121.4,34.96 90 top
S2_OSC  95.4,34.96 90 top
S3_OSC  69.4,34.96 90 top
SHIFT_REG_C1  125.73,19.05 90 top
SHIFT_REG_C2  100,20.46 90 top
SHIFT_REG_C3  74,20.46 90 top
SHIFT_REG_P1  48,27.65 90 top
TRANSMIT_BUTTON  25.4,12.7 180 top

### Tracks (layer width: path | path; a pad name or v marks a point on that pad's centre or on a via)
8B_INPUT_LADDER
  Top 0.203: 8B_INPUT_R2R.16 26.54,27.94 27.14,27.33 31.14,27.33 MCU-P1.26
C1-OE
  Top 0.203: MCU-C1.3 117.57,19.03 123.95,12.65 125.5,12.65 SHIFT_REG_C1.2
C1-RCLK
  Top 0.203: MCU-C1.4 117.53,21.57 123.95,15.15 125.5,15.15 SHIFT_REG_C1.3
C1-SER
  Top 0.203: MCU-C1.2 117.93,16.49 124.27,10.15 125.5,10.15 SHIFT_REG_C1.1
C1-SRCLK
  Top 0.203: MCU-C1.5 117.49,24.11 123.45,18.15 125.5,18.15 SHIFT_REG_C1.4
C1-SRCLR
  Top 0.203: MCU-C1.6 117.32,26.65 123.32,20.65 125.5,20.65 SHIFT_REG_C1.5
C1_HELLO_I2C
  Top 0.203: R9.1 112,50.65 112,42.15 116.5,42.15 MCU-C1.12
C1_HELLO_SPI
  Top 0.203: R6.1 114.5,50.65 114.5,48.97 117.68,48.97 120.5,46.15 120.5,39.15 117,39.15 MCU-C1.11
C1_POT1
  Bottom 0.203: 108,66.15 111.5,62.65 111.5,19.03 MCU-C1.26
C2-OE
  Top 0.203: MCU-C2.3 92.21,19.03 97.04,14.2 99.45,14.2 99.5,14.15 100,14.15 SHIFT_REG_C2.2
C2-RCLK
  Top 0.203: MCU-C2.4 92.17,21.57 97.04,16.7 99.45,16.7 99.5,16.65 SHIFT_REG_C2.3
C2-SER
  Top 0.203: MCU-C2.2 91.93,16.49 96.72,11.7 99.45,11.7 99.5,11.65 100,11.65 SHIFT_REG_C2.1
C2-SRCLK
  Top 0.203: MCU-C2.5 91.81,24.11 96.59,19.33 100,19.33 SHIFT_REG_C2.4
C2-SRCLR
  Top 0.203: MCU-C2.6 91.32,26.65 96.32,21.65 100,21.65 SHIFT_REG_C2.5
C2_HELLO_I2C
  Top 0.203: R10.1 86.5,50.15 86.5,47.7 88.55,45.65 92.95,45.65 93.95,44.65 93.95,42.15 91,42.15 MCU-C2.12
C2_HELLO_PWM
  Top 0.203: R13.1 84,50.15 84,48.47 87.82,44.65 90.5,44.65 MCU-C2.13
C2_HELLO_SPI  (via drill 0.35)
  Top 0.203: v88.5,47.65 88.5,50.15 R7.1
  Bottom 0.203: v88.5,47.65 88.5,41.65 90,40.15 90,39.65 90.5,39.15 MCU-C2.11
C2_ICP1  (via drill 0.35)
  Top 0.203: v57,60.65 60,63.65 71,63.65 76,58.65 82.5,58.65 83,59.15 90,59.15 90.82,58.33 MCU-C2.14
  Bottom 0.203: v57,60.65 55.09,60.65 46.83,52.38 46.83,47.65 39,47.65 MCU-P1.11
C2_POT1
  Bottom 0.203: 73.5,65.65 73.5,65.15 76.5,62.15 76.5,19.15 83,19.15 MCU-C2.26
C3-OE
  Top 0.203: MCU-C3.3 65.89,19.03 70.72,14.2 73.45,14.2 73.5,14.15 74,14.15 SHIFT_REG_C3.2
C3-RCLK
  Top 0.203: MCU-C3.4 65.85,21.57 70.72,16.7 73.45,16.7 73.5,16.65 SHIFT_REG_C3.3
C3-SER
  Top 0.203: MCU-C3.2 65.93,16.49 70.72,11.7 73.45,11.7 73.5,11.65 74,11.65 SHIFT_REG_C3.1
C3-SRCLK
  Top 0.203: MCU-C3.5 66.13,24.11 70.91,19.33 74,19.33 SHIFT_REG_C3.4
C3-SRCLR
  Top 0.203: MCU-C3.6 65.32,26.65 70.32,21.65 74,21.65 SHIFT_REG_C3.5
C3_HELLO_I2C
  Top 0.203: MCU-C3.12 64.87,41.83 67.5,41.83 67.5,46.65 65.64,48.52 61,48.52 61,50.65 R11.1
C3_HELLO_PWM
  Top 0.203: R14.1 58.29,50.22 63.84,44.43 MCU-C3.13
C3_HELLO_SPI  (via drill 0.35)
  Top 0.203: v66.91,48.74 65,50.65 63.5,50.65 R8.1
  Bottom 0.203: v66.91,48.74 67,48.74 67,40.38 65.97,39.35 MCU-C3.11
C3_ICP1  (via drill 0.35)
  Top 0.203: v60.82,46.38 58.55,48.65 42.5,48.65 41,50.15 39,50.15 MCU-P1.12
  Bottom 0.203: MCU-C3.14 64.22,46.38 v60.82,46.38
C3_POT1
  Bottom 0.203: 80.47,66.05 76.36,70.15 68.32,70.15 54.57,56.41 54.57,49.85 56.9,49.85 59.5,47.24 59.5,19.03 MCU-C3.26
CHIP_SELECT_LADDER
  Top 0.203: CHIP_SELECT_R2R.16 26.5,49.65 26.5,44.42 25.82,43.74 25.82,33.97 27.45,32.33 31.17,32.33 MCU-P1.24
COM_SELECT_LADDER
  Top 0.203: COM_SELECT_R2R.16 23.5,45.65 22.5,45.65 22,45.15 22,32.83 25,29.83 31.16,29.83 MCU-P1.25
CS1
  Bottom 0.203: MCU-P1.16 31.5,52.65 52.5,73.65 95.5,73.65 95.5,55.93 107,44.43 MCU-C1.16
CS2  (via drill 0.35)  (1 unrouted)
  Top 0.203: 31.5,55.65 31.5,56.65 47,56.65 50.5,53.15 v55.87,53.15 | v73.5,53.15 82,44.65 83,44.65 MCU-C2.16
  Bottom 0.203: v73.5,53.15 v55.87,53.15
CS3  (via drill 0.35)  (1 unrouted)
  Top 0.203: 40.01,55.1 42.82,52.28 48.64,52.28 v50.23,50.7
  Bottom 0.203: v50.23,50.7 50.34,50.81 57,44.15 MCU-C3.16
GND  (via drill 0.35)
  Top 0.203: C1.2 49.02,45.72 v50.8,45.72 | C6.2 v50.79,40.65 v50.8,40.64
  pour Top: -1.27,78.74 132.08,78.74 132.08,-2.54 -1.27,-2.54
  pour Bottom: -2.54,77.47 -2.54,-2.54 130.81,-2.54 130.81,77.47
MISO
  Top 0.203: 83,39.15 84.27,39.15 85.27,38.15 92.5,38.15 93.5,39.15 109,39.15 MCU-C1.18 | 83,39.15 68.5,39.15 67.5,38.1 58.5,38.1 57.5,39.15 MCU-C3.18 57,39.65 56,39.65 52,43.76 36.59,43.76 32.7,47.54 MCU-P1.18 | 83,39.15 MCU-C2.18
MOSI
  Top 0.203: MCU-C1.17 107.02,41.89 105.78,40.65 86.06,40.65 84.82,41.89 MCU-C2.17 83,41.65 82,41.65 81,40.65 58.5,40.65 57.5,41.65 MCU-C3.17 57,42.15 56,42.15 51,47.15 42.05,47.15 40.23,48.85 34.09,48.85 32.98,50.08 MCU-P1.17
N$1
  Top 0.203: LED1.A 37,71.15 40.5,71.15 R2.2
N$2
  Top 0.203: C8.1 125,32.65 121.5,32.65 S1_OSC.P$1 119.65,34.27 MCU-C1.9
N$3
  Top 0.203: C7.1 125,37.65 121.5,37.65 S1_OSC.P$2 121.19,37.53 120.47,36.81 MCU-C1.10
N$4
  Top 0.508: 8B_INPUT_R2R.8 16.51,19.05 8.89,11.43 8B_INPUT_DIP.1
N$5
  Top 0.203: C6.1 43.5,40.65 M1_OSC.P$1 41.84,42.42 38.84,42.42 MCU-P1.9
N$6
  Top 0.203: C1.1 43.5,45.65 M1_OSC.P$2 43,45.15 39,45.15 MCU-P1.10
N$7
  Top 0.203: C5.1 99,32.65 95.5,32.65 S2_OSC.P$1 93.65,34.27 MCU-C2.9
N$8
  Top 0.203: S2_OSC.P$2 94.7,36.7 90.92,36.7 MCU-C2.10
  Top 0.508: S2_OSC.P$2 98.99,37.4 C4.1
N$9
  Top 0.203: C10.1 73,32.65 69.5,32.65 S3_OSC.P$1 69,32.65 66.5,32.65 65,34.15 MCU-C3.9
N$10
  Top 0.203: C9.1 73,37.65 69.5,37.65 S3_OSC.P$2 69,37.65 65.5,37.65 65,37.15 MCU-C3.10
N$11
  Top 0.508: 8B_INPUT_DIP.2 8.89,13.97 15.24,20.32 8B_INPUT_R2R.7
N$12
  Top 0.203: C1_SPI.A 114.5,55.65 114.5,53.15 R6.2
N$13
  Top 0.203: C2_SPI.A 89,55.15 89,52.65 R7.2
N$14
  Top 0.203: C3_SPI.A 63.5,55.65 63.5,53.15 R8.2
N$15
  Top 0.203: C1_I2C.A 112,55.65 112,53.15 R9.2
N$16
  Top 0.203: C2_I2C.A 86.5,55.15 86.5,52.65 R10.2
N$17
  Top 0.203: C3_I2C.A 61,55.65 61,53.15 R11.2
N$18
  Top 0.203: COM_SELECT_R2R.8 4.64,36.83 4.66,36.8 COM_SELECT_DIP.1
N$19
  Top 0.203: C2_PWM.A 84,55.15 84,52.65 R13.2
N$20
  Top 0.203: C3_PWM.A 58.5,55.65 58.5,53.15 R14.2
N$21
  Top 0.508: 8B_INPUT_R2R.6 13.97,21.59 8.89,16.51 8B_INPUT_DIP.3
N$22
  Top 0.508: 8B_INPUT_R2R.5 12.7,22.86 8.89,19.05 8B_INPUT_DIP.4
N$23
  Top 0.508: 8B_INPUT_R2R.4 11.43,24.13 8.89,21.59 8B_INPUT_DIP.5
N$24
  Top 0.508: 8B_INPUT_R2R.3 10.16,25.4 8.89,24.13 8B_INPUT_DIP.6
N$25
  Top 0.508: 8B_INPUT_DIP.7 8B_INPUT_R2R.2
N$26
  Top 0.508: 8B_INPUT_DIP.8 4.14,27.94 8B_INPUT_R2R.1
N$27
  Top 0.203: COM_SELECT_DIP.2 3,38.15 17,38.15 COM_SELECT_R2R.7
N$28
  Top 0.203: COM_SELECT_DIP.3 3,40.15 4,39.15 17,39.15 COM_SELECT_R2R.6
N$29
  Top 0.203: COM_SELECT_DIP.4 3,43.15 5.5,40.65 17,40.65 COM_SELECT_R2R.5
N$30
  Top 0.203: COM_SELECT_DIP.5 3,45.65 6.5,42.15 17,42.15 COM_SELECT_R2R.4
N$31
  Top 0.203: COM_SELECT_DIP.6 3,48.15 8,43.15 17,43.15 COM_SELECT_R2R.3
N$32
  Top 0.203: COM_SELECT_DIP.7 3,50.65 9,44.65 17,44.65 COM_SELECT_R2R.2
N$33
  Top 0.203: COM_SELECT_DIP.8 3,53.15 10.5,45.65 17,45.65 COM_SELECT_R2R.1
N$34
  Top 0.203: CHIP_SELECT_DIP.1 12.7,67.14 17.78,62.06 CHIP_SELECT_R2R.8
N$35
  Top 0.203: CHIP_SELECT_DIP.2 15.5,70.65 15.5,66.61 19,63.11 19,56.65 CHIP_SELECT_R2R.7
N$36
  Top 0.203: CHIP_SELECT_DIP.3 18,70.65 18,66.38 20.5,63.88 20.5,56.65 CHIP_SELECT_R2R.6
N$37
  Top 0.203: CHIP_SELECT_DIP.4 20.5,70.65 20.5,68.04 21.5,67.04 21.5,56.65 CHIP_SELECT_R2R.5
N$38
  Top 0.203: CHIP_SELECT_DIP.5 23,70.65 23,56.65 CHIP_SELECT_R2R.4
N$39
  Top 0.203: CHIP_SELECT_DIP.6 25.5,70.65 25.5,64.23 24,62.73 24,56.65 CHIP_SELECT_R2R.3
N$40
  Top 0.203: CHIP_SELECT_DIP.7 27.94,64.74 25.5,62.3 25.5,56.65 CHIP_SELECT_R2R.2
N$41
  Top 0.203: CHIP_SELECT_DIP.8 30.48,64.78 26.67,60.97 CHIP_SELECT_R2R.1
P1-OE
  Top 0.203: MCU-P1.3 40.2,27.22 46.27,21.15 48,21.15 SHIFT_REG_P1.2
P1-RCLK
  Top 0.203: MCU-P1.4 40.48,29.76 46.27,23.97 47.87,23.97 SHIFT_REG_P1.3
P1-SER
  Top 0.203: MCU-P1.2 39.92,24.68 45.77,18.83 48,18.83 SHIFT_REG_P1.1
P1-SRCLK
  Bottom 0.203: MCU-P1.6 47.32,26.33 47.95,26.33 SHIFT_REG_P1.4
P1-SRCLR
  Bottom 0.203: MCU-P1.13 38.5,52.15 36.68,50.33 36.68,47.15 37.68,46.25 41.5,46.25 41.5,34.65 47,29.15 48,29.15 SHIFT_REG_P1.5
P1_POT
  Bottom 0.203: 31.5,34.65 33.96,34.65 33.96,52.93 39.68,58.65 51.46,58.65 51.46,61.11 56,65.65 P1_POT.P$2
RESET1
  Top 0.203: R3.2 113,10.65 116,13.65 116.5,13.65 MCU-C1.1
RESET2  (via drill 0.35)
  Top 0.203: v84.69,10.65 87,10.65 R4.2
  Bottom 0.203: MCU-C2.1 87.5,10.65 v84.69,10.65
RESET3  (via drill 0.35)
  Top 0.203: v62.5,10.65 61,10.65 R5.2
  Bottom 0.203: v62.5,10.65 64.5,12.65 64.5,13.65 MCU-C3.1
RESET_BUTTON  (via drill 0.35)  (1 unrouted)
  Top 0.203: v41,15.15 41,10.65 R1.2 | 53,54.65 52.82,54.47 v50.55,54.47
  Bottom 0.203: MCU-P1.1 39,21.65 39,17.15 v41,15.15 47,15.15 52.07,19.05 52.07,46.99 48.59,50.46 48.59,52.52 v50.55,54.47
SCK
  Top 0.203: MCU-C1.19 105.06,36.81 103.69,35.5 87.54,35.5 86.54,36.65 83.5,36.65 MCU-C2.19 83,36.65 78.78,36.65 77.78,35.5 58.5,35.5 57.5,36.65 MCU-C3.19 57,37.15 56,37.15 54.5,38.65 36.27,38.65 35.63,39.28 35.63,41.51 32.14,45 MCU-P1.19
SCL
  Top 0.203: R15.2 48,10.65 51.18,13.83 57.07,13.83 MCU-C3.28 57.21,13.97 60.82,13.97 65.45,9.33 78.68,9.33 81.5,12.15 | 81.5,12.15 83,13.65 MCU-C2.28 | MCU-C1.28 108.35,13.95 103.73,9.33 90.82,9.33 88,12.15 81.5,12.15
  Bottom 0.203: MCU-P1.28 36.56,13.65 57,13.65 MCU-C3.28
SDA
  Top 0.203: 48,16.15 48,13.15 R16.2 | 48,16.15 57,16.15 MCU-C3.27 57.5,16.15 59.95,16.15 65.95,10.15 77,10.15 83,16.15 MCU-C2.27 83.5,16.15 84.5,16.15 88,12.65 91,12.65 93.5,10.15 102.22,10.15 108.56,16.49 MCU-C1.27 | 48,16.15 41.91,16.15 33.41,24.65 33.09,24.68 MCU-P1.27
TRANSMIT_BUTTON
  Top 0.203: TRANSMIT_BUTTON.3 28.68,16.22 28.68,25.9 33.52,25.9 35,27.38 35,31.03 36.27,32.3 MCU-P1.5
VCC_ARDUINO  (via drill 0.35)
  Top 0.508: R16.1 46,12.65 46,10.65 R15.1 46,10.15 46,8.15 | 42,8.15 15.5,8.15 12.5,11.15 8B_INPUT_DIP.+ 19.05,11.43 19.05,32.6 19,32.65 | 42,8.15 43,9.15 43,10.15 R1.1 | 19,32.65 18.5,33.15 12.5,33.15 12.5,35.15 COM_SELECT_DIP.+ | 42,8.15 46,8.15 | 46,8.15 61,8.15 R5.1 61.49,8.02 86.5,8.02 R4.1 87.18,8.33 112.82,8.33 R3.1 | C1_POT.P$1 107.5,63.15 104.28,63.15 102.78,64.65 92,64.65 91,63.65 C3_POT.P$1 90.5,63.65 90,64.15 72.5,64.15 | 54.5,61.65 54,61.15 50,61.15 5V_REG.OUT | 54.5,61.65 56,63.15 P1_POT.P$1 | 72.5,64.15 72,64.65 60,64.65 57,61.65 54.5,61.65 | 72.5,64.15 73,63.65 C2_POT.P$1 | 29,42.15 31,42.15 MCU-P1.20 MCU-P1.21 31.34,39.78 33.13,39.78 35.45,37.47 38.72,37.47 MCU-P1.7 39,37.15 39.5,37.15 41,35.65 43,35.65 | 29,42.15 27.5,42.15 C11.1 | 27.5,54.65 15.5,54.65 15.5,58.65 13,61.15 CHIP_SELECT_DIP.+ | 27.5,54.65 36,63.15 39,63.15 C3.1 39,63.65 40,64.65 40.5,64.65 | 40.5,64.65 40.5,68.65 R2.1 | 29,42.15 29,54.65 27.5,54.65 | C15.1 106,34.65 109,34.65 MCU-C1.20 109,34.15 109,32.15 MCU-C1.21 | SHIFT_REG_C1.7 125.5,25.65 124,25.65 122.5,27.15 121,27.15 C13.1 121,29.15 117,29.15 MCU-C1.7 113,29.19 113,31.73 MCU-C1.21 | C17.1 80,34.65 83,34.65 MCU-C2.20 83,34.15 83,32.15 MCU-C2.21 | 100,27.15 95,27.15 C12.1 95,27.65 92.5,27.65 91,29.15 MCU-C2.7 90.5,29.15 87,29.15 87,31.73 MCU-C2.21 | 74,27.15 69,27.15 C14.1 69,29.19 MCU-C3.7 64.5,29.15 60.5,29.15 58,31.65 57.5,31.65 MCU-C3.21 57,32.15 57,34.15 MCU-C3.20 57,34.65 54,34.65 C18.1 54,34.15 48,34.15 SHIFT_REG_P1.7 48,33.65 46,33.65 44,35.65 43,35.65 | 43,35.65 C16.1 | 74,27.15 78.18,27.15 82.45,31.42 MCU-C2.21
  Top 0.508: 74,27.15 SHIFT_REG_C3.7 | 100,27.15 103.55,27.15 107.36,30.96 MCU-C1.21 | 100,27.15 SHIFT_REG_C2.7 | 54.5,61.65 51.5,64.65 40.5,64.65 | 19,32.65 19.05,32.7 v20.05,32.7
  Bottom 0.508: v20.05,32.7 30,42.65 31,42.65 MCU-P1.20
VOLTAGE_INPUT
  Top 0.508: C2.1 53.02,57.79 44.45,57.79 5V_REG.IN
  Bottom 0.508: INPUT.1 51,69.65 44.5,63.15 44.5,61.15 5V_REG.IN